# Altium schematic sheet power_board.SchDoc
size A4
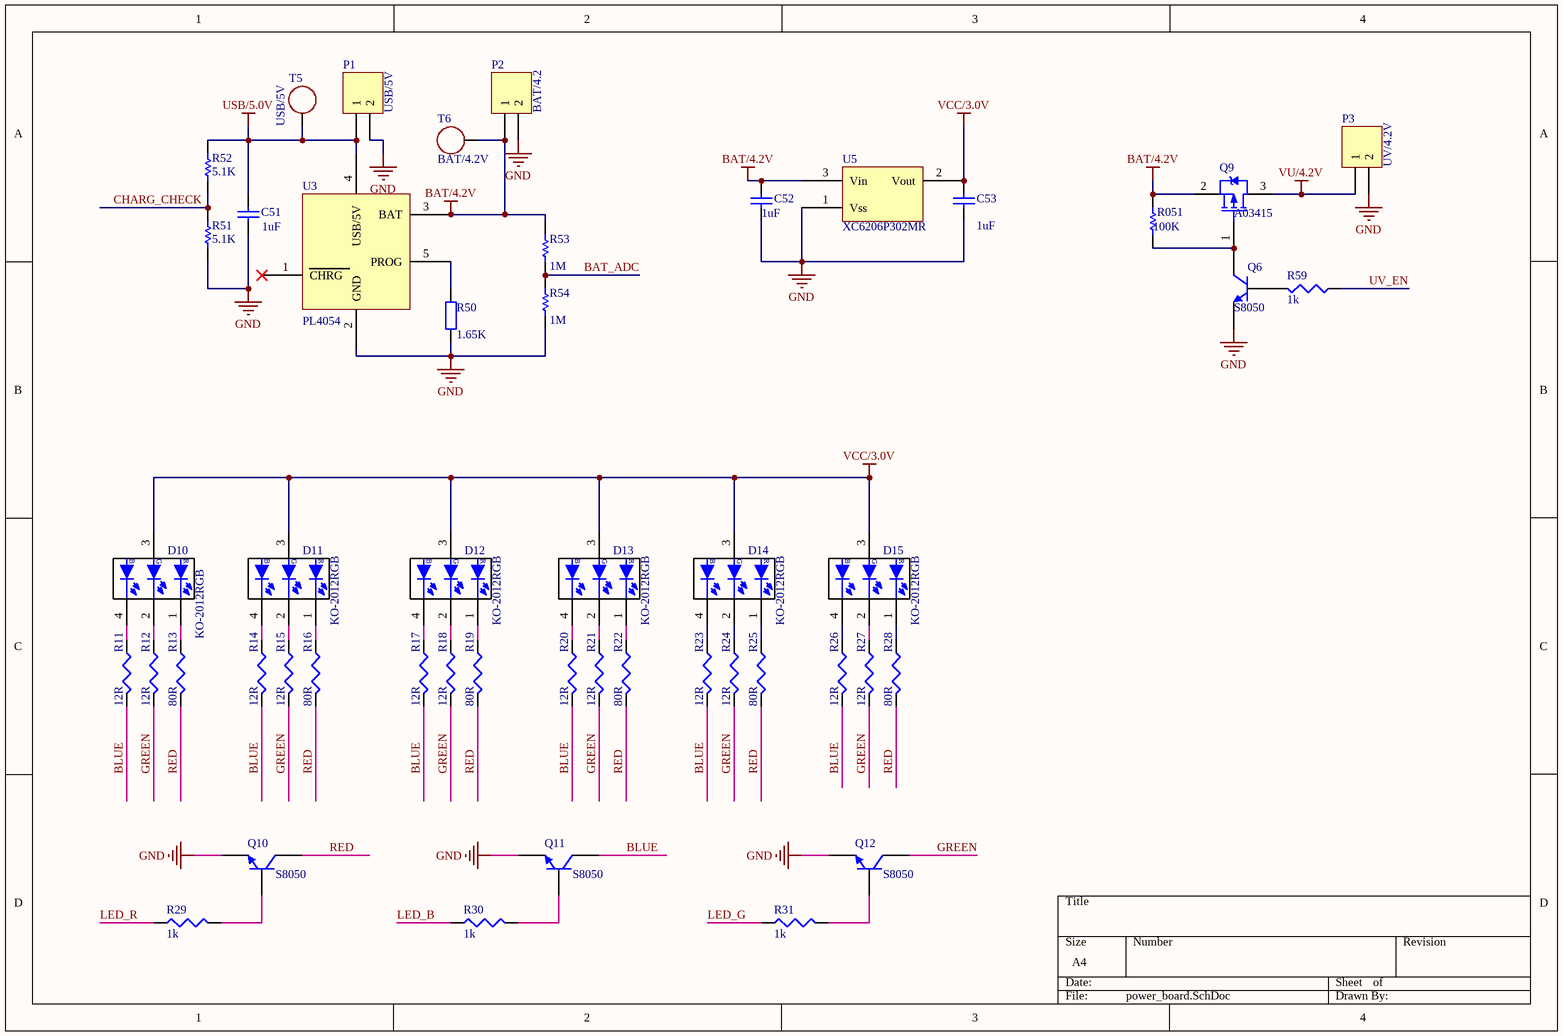
[diagram p0: power_board.SchDoc]

## Parts
C51  value 1uF  [C0402]  (hidden comment: Cap)
C52  value 1uF  [C0402]  (hidden comment: Cap)
C53  value 1uF  [C0402]  (hidden comment: Cap)
D10  KO-2012RGB  [KO-2012RGB]
D11  KO-2012RGB  [KO-2012RGB]
D12  KO-2012RGB  [KO-2012RGB]
D13  KO-2012RGB  [KO-2012RGB]
D14  KO-2012RGB  [KO-2012RGB]
D15  KO-2012RGB  [KO-2012RGB]
P1  USB/5V  [USB5.0V]
P2  BAT/4.2  [CON_1.25MM_2P]
P3  UV/4.2V  [CON_1.25MM_2P]
Q6  S8050  [SOT23]
Q9  A03415  [SOT23]
Q10  S8050  [SOT23]
Q11  S8050  [SOT23]
Q12  S8050  [SOT23]
R11  value 12R  [R0402]  (hidden comment: 1.2k)
R12  value 12R  [R0402]  (hidden comment: 1.2k)
R13  value 80R  [R0402]  (hidden comment: 1.2k)
R14  value 12R  [R0402]  (hidden comment: 1.2k)
R15  value 12R  [R0402]  (hidden comment: 1.2k)
R16  value 80R  [R0402]  (hidden comment: 1.2k)
R17  value 12R  [R0402]  (hidden comment: 1.2k)
R18  value 12R  [R0402]  (hidden comment: 1.2k)
R19  value 80R  [R0402]  (hidden comment: 1.2k)
R20  value 12R  [R0402]  (hidden comment: 1.2k)
R21  value 12R  [R0402]  (hidden comment: 1.2k)
R22  value 80R  [R0402]  (hidden comment: 1.2k)
R23  value 12R  [R0402]  (hidden comment: 1.2k)
R24  value 12R  [R0402]  (hidden comment: 1.2k)
R25  value 80R  [R0402]  (hidden comment: 1.2k)
R26  value 12R  [R0402]  (hidden comment: 1.2k)
R27  value 12R  [R0402]  (hidden comment: 1.2k)
R28  value 80R  [R0402]  (hidden comment: 1.2k)
R29  value 1k  [R0402]  (hidden comment: 1.2k)
R30  value 1k  [R0402]  (hidden comment: 1.2k)
R31  value 1k  [R0402]  (hidden comment: 1.2k)
R50  value 1.65K  [R0402]  (hidden comment: Res2)
R51  value 5.1K  [R0402]  (hidden comment: Res1)
R051  value 100K  [R0402]  (hidden comment: Res1)
R52  value 5.1K  [R0402]  (hidden comment: Res1)
R53  value 1M  [R0402]  (hidden comment: Res1)
R54  value 1M  [R0402]  (hidden comment: Res1)
R59  value 1k  [R0402]  (hidden comment: 1.2k)
T5  USB/5V  [TP1_3MMD]
T6  BAT/4.2V  [TP1_3MMD]
U3  PL4054  [SOT23-5]
U5  XC6206P302MR  [SOT23]

## Nets
BAT/4.2V: C52.2 P2.1 Q9.2(S) R051.2 R53.2 T6.1(TOUCHPAD) U3.3(BAT) U5.3(Vin)
GND: C51.1 C52.1 C53.1 P1.2 P2.2 P3.2 Q6.2(E) Q10.2(E) Q11.2(E) Q12.2(E) R50.1 R51.1 R54.1 U3.2(GND) U5.1(Vss)
USB/5.0V: C51.2 P1.1 R52.2 T5.1(TOUCHPAD) U3.4(USB/5V)
VCC/3.0V: C53.2 D10.3(+) D11.3(+) D12.3(+) D13.3(+) D14.3(+) D15.3(+) U5.2(Vout)
VU/4.2V: P3.1 Q9.3(D)
BAT_ADC: R53.1 R54.2
BLUE: Q11.3(C) R11.2 R14.2 R17.2 R20.2 R23.2 R26.2
CHARG_CHECK: R51.2 R52.1
GREEN: Q12.3(C) R12.2 R15.2 R18.2 R21.2 R24.2 R27.2
LED_B: R30.1
LED_G: R31.1
LED_R: R29.1
RED: Q10.3(C) R13.2 R16.2 R19.2 R22.2 R25.2 R28.2
UV_EN: R59.1
NetD10_1: D10.1(R) R13.1
NetD10_2: D10.2(G) R12.1
NetD10_4: D10.4(B) R11.1
NetD11_1: D11.1(R) R16.1
NetD11_2: D11.2(G) R15.1
NetD11_4: D11.4(B) R14.1
NetD12_1: D12.1(R) R19.1
NetD12_2: D12.2(G) R18.1
NetD12_4: D12.4(B) R17.1
NetD13_1: D13.1(R) R22.1
NetD13_2: D13.2(G) R21.1
NetD13_4: D13.4(B) R20.1
NetD14_1: D14.1(R) R25.1
NetD14_2: D14.2(G) R24.1
NetD14_4: D14.4(B) R23.1
NetD15_1: D15.1(R) R28.1
NetD15_2: D15.2(G) R27.1
NetD15_4: D15.4(B) R26.1
NetQ6_1: Q6.1(B) R59.2
NetQ6_3: Q6.3(C) Q9.1(G) R051.1
NetQ10_1: Q10.1(B) R29.2
NetQ11_1: Q11.1(B) R30.2
NetQ12_1: Q12.1(B) R31.2
NetR50_2: R50.2 U3.5(PROG)

Not connected (* = marked no-connect by the designer): U3 1(CHRG)*

## Library data of the parts
C51-C53 = Cap: 电容; Published: 8-Jun-2000; LatestRevisionDate: 17-Jul-2002; LatestRevisionNote: Re-released for DXP Platform.; PackageReference: RAD-0.3; Publisher: Altium Limited; PackageDescription: Radial Cap, Thru-Hole; 2 Leads; 0.3 in Pin Spacing
D10-D15 = KO-2012RGB: 三色LED
P1 = Header 2: 充电焊接口; LatestRevisionDate: 17-Jul-2002; LatestRevisionNote: Re-released for DXP Platform.; Publisher: Altium Limited
P2 = Header 2: 电池连接母座; LatestRevisionDate: 17-Jul-2002; LatestRevisionNote: Re-released for DXP Platform.; Publisher: Altium Limited
P3 = Header 2: UV灯接口; LatestRevisionDate: 17-Jul-2002; LatestRevisionNote: Re-released for DXP Platform.; Publisher: Altium Limited
Q6 Q10-Q12 = S8050: 三极管
Q9 = A03415: PMOS管
R11-R31 R59 = Res3: 电阻; Published: 8-Jun-2000; LatestRevisionDate: 29-May-2009; LatestRevisionNote: IPC-7351 Footprint Added.; PackageReference: J1-0603; Publisher: Altium Limited; PackageDescription: Chip Resistor
R50 = Res2: 电阻; Published: 8-Jun-2000; LatestRevisionDate: 17-Jul-2002; LatestRevisionNote: Re-released for DXP Platform.; PackageReference: AXIAL-0.4; Publisher: Altium Limited; PackageDescription: Axial Device, Thru-Hole; 2 Leads; 0.4 in Pin Spacing
R51 R051-R54 = Res1: 电阻; Published: 8-Jun-2000; LatestRevisionDate: 17-Jul-2002; LatestRevisionNote: Re-released for DXP Platform.; PackageReference: AXIAL-0.3; Publisher: Altium Limited; PackageDescription: Axial Device, Thru-Hole; 2 Leads; 0.3 in Pin Spacing
T5 = TEST: USB充电检测点
T6 = TEST: 电池检测点
U3 = PL4054: 充电IC
U5 = XC6206P302MR: 稳压IC